# EasyEDA Pro project PCB.epro

# Board PCB1
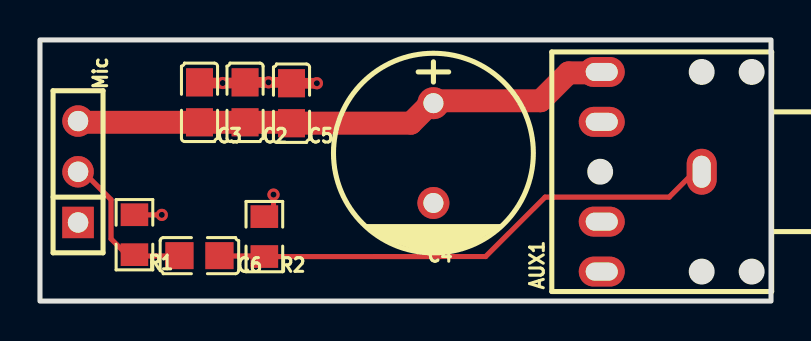
[diagram p0: board, top side]
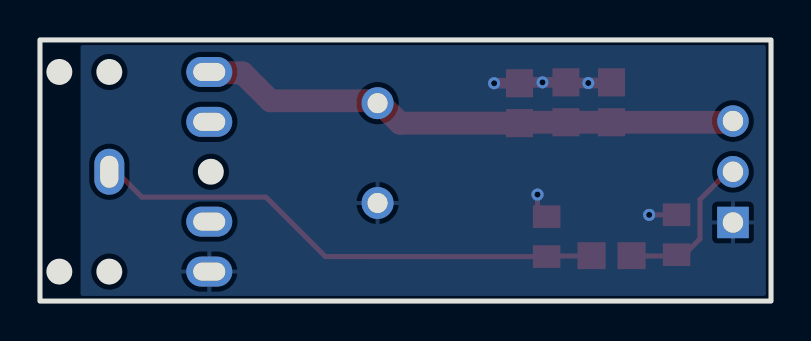
[diagram p1: board, bottom side, seen from below]

Outline 36.58 x 13.08 mm; copper layers: Top Layer, Bottom Layer. Coordinates in mm from the lower left corner of the outline.
Outline path: rectangle 0,13.08 36.58,0
Stack: Top Layer 0.035mm / Dielectric1 1.51mm FR4 er 4.5 / Bottom Layer 0.035mm

## Design rules (mm)
template: JLCPCB Capability(Two Layers Board)
spacing copperThickness1oz (default): track to track 0.102, other pairs 0.152 to 0.3
spacing copperThickness2oz: track to track 0.203, other pairs 0.152 to 0.3
track width copperThickness1oz (default): min 0.127, default 0.254, max 2.54
track width copperThickness2oz: min 0.203, default 0.254, max 2.54
differential pair differentialPair (default): width min 0.127, default 0.254, max 2.54; gap min 0.152, default 0.152
via viaSize (default): diameter min 0.5, default 0.61, max 10; hole min 0.3, default 0.305, max 6.3

## Placement (name value [footprint] x y rotation side)
AUX1  PJ-3126-5A  [AUDIO-TH_PJ-3126-5A]  30.61 6.48 270 top
C2  100nF  [C0805]  10.26 9.96 90 top
C3  100nF  [C0805]  7.98 9.96 90 top
C4  1000uF  [CAP-TH_BD10.0-P5.00-D0.6-FD]  19.69 7.41 270 top
C5  1nF  [C0805]  12.59 9.91 90 top
C6  100nF  [C0805]  7.98 2.27 180 top
Mic  -  [HDR-TH_3P-P2.54-V-F]  1.91 6.48 90 top
R1  5.6K  [R0805]  4.73 3.32 270 top
R2  120K  [R0805]  11.23 3.23 270 top

## Footprints (pads in the part's own frame, mm; a bottom-side part is the same pattern mirrored in y, then rotated)
AUDIO-TH_PJ-3126-5A
  oval 2.3x1.5 hole 1.601x0.9: 1(-0.002,2.501)
  oval 1.5x2.3 hole 0.9x1.6: 2(-5,-2.501) 3(-2.501,-2.501) 4(2.498,-2.501) 5(5,-2.501)
C0805
  rect 1.41x1.35 smd: 1(-1,0) 2(1,0)
CAP-TH_BD10.0-P5.00-D0.6-FD
  round 1.6 hole 1: 1(-2.5,0) 2(2.5,0)
HDR-TH_3P-P2.54-V-F
  rect 1.575x1.575 hole 1.02: 1(-2.54,0)
  round 1.575 hole 1.02: 2(0,0) 3(2.54,0)
R0805
  rect 1.133x1.377 smd: 1(-1,0) 2(1,0)

## Nets
+5V: AUX1.2 C2.1 C3.1 C4.1 C5.1 Mic.3
GND: AUX1.5 C2.2 C3.2 C4.2 C5.2 Mic.1 R1.1 R2.1
$1N192: C6.2 Mic.2 R1.2
$1N1157: AUX1.1 C6.1 R2.2

Pads without a net: AUX1 3 4

## Via types
v1: diameter 0.61, hole 0.305, Top Layer to Bottom Layer, 5 vias

## Routing (per net, layer and track width the routed paths; a pad name or vN(x,y) marks a point on that pad's centre or on a via; arc(x,y) is an arc through that point)
+5V: length 27.4
  Top Layer w0.254: 1.84,8.96 1.78,8.89 ; C5.1 12.54,8.96
  Top Layer w1.143: C5.1 18.56,8.91 19.69,10.03 25.05,10.03 26.44,11.43 28.06,11.43 AUX1.2 ; 12.54,8.96 C2.1 C3.1 1.84,8.96
GND: length 8.6
  Top Layer w0.254: v1(11.68,5.33) 11.68,4.69 R2.1 ; v1(6.1,4.32) 4.59,4.32 4.47,4.2
  Top Layer w0.533: 12.84,10.91 v1(13.85,10.91) ; 12.57,10.91 12.52,10.96 v1(11.43,10.96) C2.2 10.23,10.92 v1(9.14,10.92) 8.02,10.92 C3.2
$1N192: length 7.9
  Top Layer w0.254: Mic.2 2.16,6.48 3.56,5.08 3.56,3.11 4.41,2.26 6.88,2.26
$1N1157: length 26
  Top Layer w0.254: AUX1.1 32.75,6.48 31.48,5.21 25.27,5.21 22.3,2.23 R2.2 11.2,2.26 8.88,2.26

## Copper pours and planes (outline as drawn; the poured copper is in the pictures)
GND on Bottom Layer: 0,13.08 34.54,13.08 34.54,0 0,0
